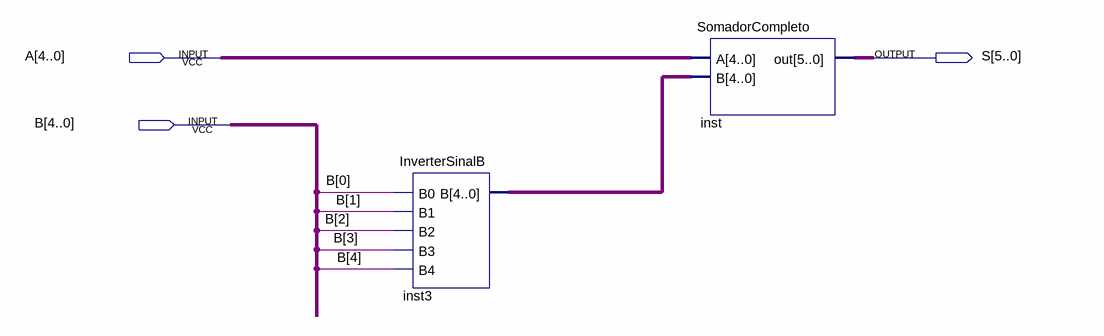
[diagram p0: schematic sheet]
// Quartus schematic Substrator.bdf as structural Verilog: 2 symbols, 3 pins
module Substrator (
  input  [4:0] A,
  input  [4:0] B,
  output [5:0] S
);

  wire [4:0] inst3_b;

  InverterSinalB inst3 (.B0(B[0]), .B1(B[1]), .B2(B[2]), .B3(B[3]), .B4(B[4]), .B(inst3_b));
  SomadorCompleto inst (.A(A), .B(inst3_b), .out(S));
endmodule
